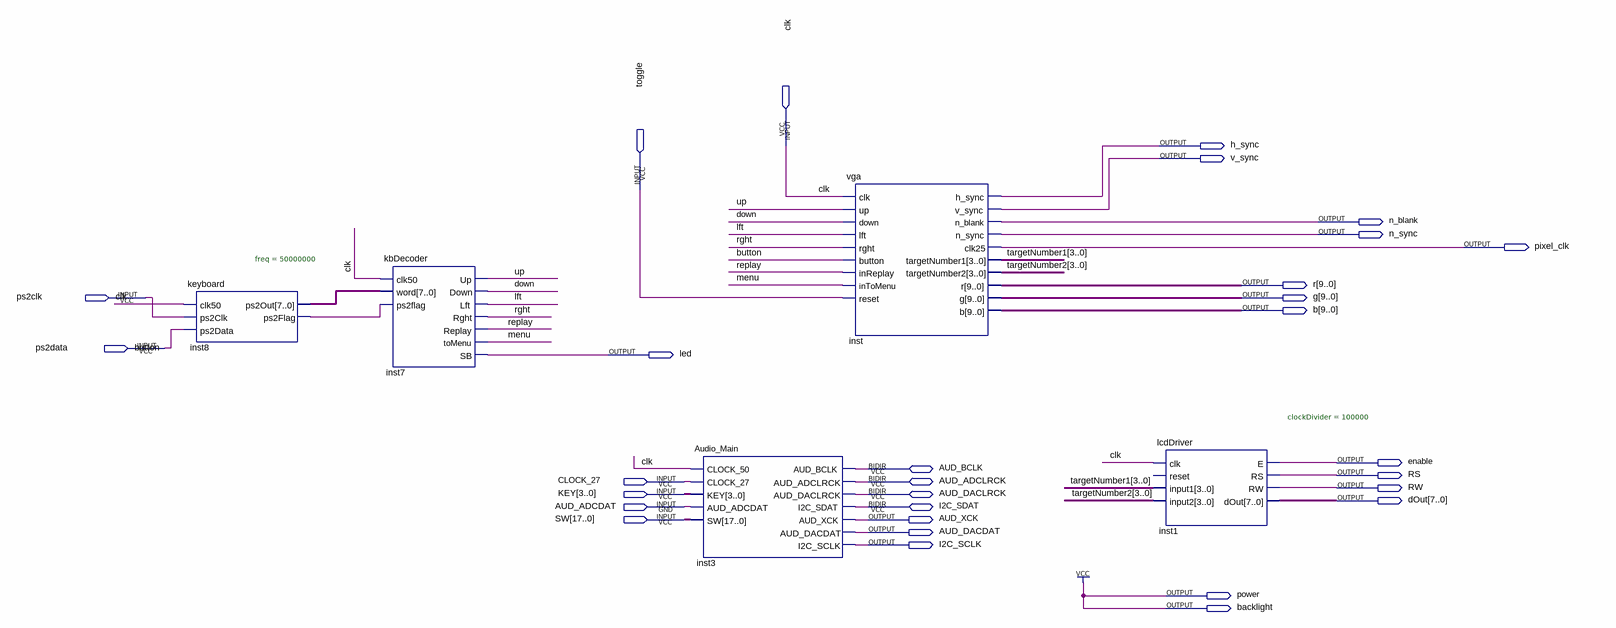
[diagram p0: schematic sheet]
// Quartus schematic vga_block.bdf as structural Verilog: 5 symbols, 30 pins
module vga_block (
  input  clk,
  input  toggle,
  input  ps2clk,
  input  ps2data,
  input  CLOCK_27,
  input  [3:0] KEY,
  input  AUD_ADCDAT,
  input  [17:0] SW,
  inout  AUD_BCLK,
  inout  AUD_ADCLRCK,
  inout  AUD_DACLRCK,
  inout  I2C_SDAT,
  output h_sync,
  output v_sync,
  output n_blank,
  output n_sync,
  output pixel_clk,
  output [9:0] r,
  output [9:0] g,
  output [9:0] b,
  output led,
  output enable,
  output RS,
  output RW,
  output [7:0] dOut,
  output AUD_XCK,
  output AUD_DACDAT,
  output I2C_SCLK,
  output power,
  output backlight
);

  wire down, inst8_ps2flag, lft, menu, replay, rght, up;
  wire [3:0] targetNumber1, targetNumber2;
  wire [7:0] inst8_ps2out;

  keyboard #(.freq(50000000)) inst8 (
    .clk50(clk), .ps2Clk(ps2clk), .ps2Data(ps2data), .ps2Out(inst8_ps2out), .ps2Flag(inst8_ps2flag));
  kbDecoder inst7 (
    .clk50(clk), .word(inst8_ps2out), .ps2flag(inst8_ps2flag), .Up(up), .Down(down), .Lft(lft), .Rght(rght),
    .Replay(replay), .toMenu(menu), .SB(led));
  Audio_Main inst3 (
    .CLOCK_50(clk), .CLOCK_27(CLOCK_27), .KEY(KEY), .AUD_ADCDAT(AUD_ADCDAT), .SW(SW), .AUD_XCK(AUD_XCK),
    .AUD_DACDAT(AUD_DACDAT), .I2C_SCLK(I2C_SCLK), .AUD_BCLK(AUD_BCLK), .AUD_ADCLRCK(AUD_ADCLRCK),
    .AUD_DACLRCK(AUD_DACLRCK), .I2C_SDAT(I2C_SDAT));
  vga inst (
    .clk(clk), .up(up), .down(down), .lft(lft), .rght(rght), .button(led), .inReplay(replay),
    .inToMenu(menu), .reset(toggle), .h_sync(h_sync), .v_sync(v_sync), .n_blank(n_blank), .n_sync(n_sync),
    .clk25(pixel_clk), .targetNumber1(targetNumber1), .targetNumber2(targetNumber2), .r(r), .g(g), .b(b));
  lcdDriver #(.clockDivider(100000)) inst1 (
    .clk(clk), .input1(targetNumber1), .input2(targetNumber2), .E(enable), .RS(RS), .RW(RW), .dOut(dOut));  // open: reset

  assign backlight = 1'b1;
  assign power = 1'b1;

  // Other names for the same wires on the sheet: button = led
endmodule
